# EAGLE design tester (EAGLE 7.3.0)
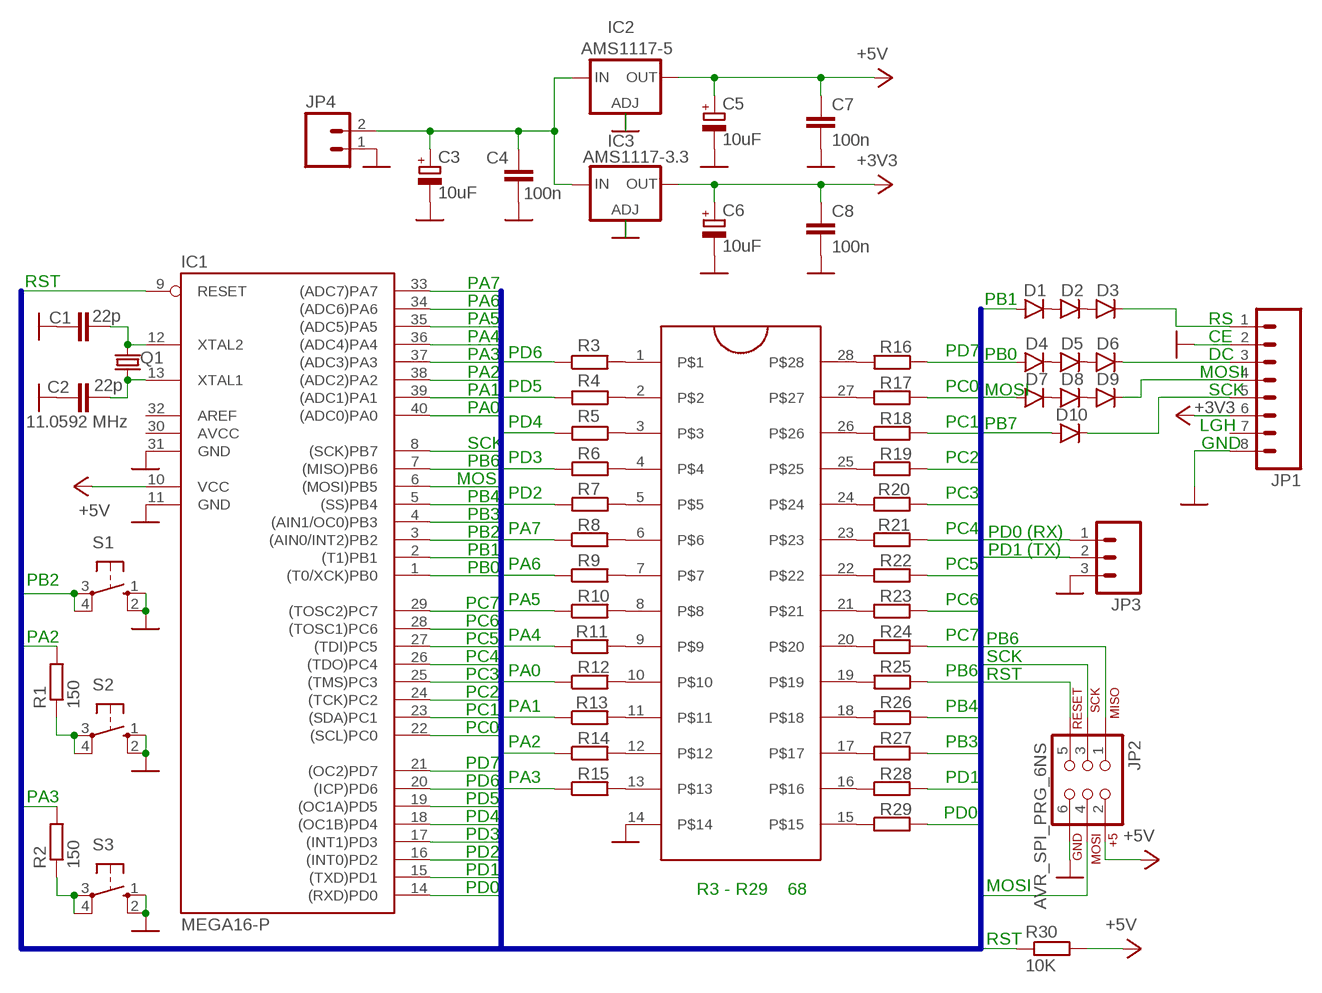
[diagram p0: schematic, sheet 1]

## Parts
C1  22p  C-EUC0805  [C0805]
C2  22p  C-EUC0805  [C0805]
C3  10uF  CPOL-EUE2.5-5  [E2,5-5]
C4  100n  C-EUC0805  [C0805]
C5  10uF  CPOL-EUE2.5-5  [E2,5-5]
C6  10uF  CPOL-EUE2.5-5  [E2,5-5]
C7  100n  C-EUC0805  [C0805]
C8  100n  C-EUC0805  [C0805]
D1  DIODESOD123  [SOD-123]
D2  DIODESOD123  [SOD-123]
D3  DIODESOD123  [SOD-123]
D4  DIODESOD123  [SOD-123]
D5  DIODESOD123  [SOD-123]
D6  DIODESOD123  [SOD-123]
D7  DIODESOD123  [SOD-123]
D8  DIODESOD123  [SOD-123]
D9  DIODESOD123  [SOD-123]
D10  DIODESOD123  [SOD-123]
IC1  MEGA16-P  [DIL40]
IC2  AMS1117-5  LD117AS50TR  [SOT223]
IC3  AMS1117-3.3  LD117AS33TR  [SOT223]
JP1  M08  [1X08_ROUND]
JP2  AVR_SPI_PRG_6NS  [2X3-NS]
JP3  M03PTH  [1X03]
JP4  M02PTH  [1X02]
Q1  11.0592 MHz  CRYSTALHC49S  [HC49/S]
R1  150  R-EU_M0805  [M0805]
R2  150  R-EU_M0805  [M0805]
R3  R-EU_M0805  [M0805]
R4  R-EU_M0805  [M0805]
R5  R-EU_M0805  [M0805]
R6  R-EU_M0805  [M0805]
R7  R-EU_M0805  [M0805]
R8  R-EU_M0805  [M0805]
R9  R-EU_M0805  [M0805]
R10  R-EU_M0805  [M0805]
R11  R-EU_M0805  [M0805]
R12  R-EU_M0805  [M0805]
R13  R-EU_M0805  [M0805]
R14  R-EU_M0805  [M0805]
R15  R-EU_M0805  [M0805]
R16  R-EU_M0805  [M0805]
R17  R-EU_M0805  [M0805]
R18  R-EU_M0805  [M0805]
R19  R-EU_M0805  [M0805]
R20  R-EU_M0805  [M0805]
R21  R-EU_M0805  [M0805]
R22  R-EU_M0805  [M0805]
R23  R-EU_M0805  [M0805]
R24  R-EU_M0805  [M0805]
R25  R-EU_M0805  [M0805]
R26  R-EU_M0805  [M0805]
R27  R-EU_M0805  [M0805]
R28  R-EU_M0805  [M0805]
R29  R-EU_M0805  [M0805]
R30  10K  R-EU_M0805  [M0805]
S1  10-XX  [B3F-10XX]
S2  10-XX  [B3F-10XX]
S3  10-XX  [B3F-10XX]
U$1  ZIFSOCKET-28-3ZIFFSOCKET-28-3  [DIL28-3-ZIF_SOCKET]

## Nets
+3V3: C6.+ C8.1 IC3.4(OUT) JP1.6
+5V: C5.+ C7.1 IC1.10(VCC) IC2.4(OUT) JP2.2 R30.2
GND: C1.1 C2.1 C3.- C4.1 C5.- C6.- C7.2 C8.2 IC1.11(GND) IC1.31(GND) IC2.1(ADJ) IC3.1(ADJ) JP1.2 JP1.8 JP2.6 JP3.3 JP4.1 S1.1(S) S1.2(S1) S2.1(S) S2.2(S1) S3.1(S) S3.2(S1) U$1.14
N$1: C2.2 IC1.13(XTAL1) Q1.1
N$2: C1.2 IC1.12(XTAL2) Q1.2
N$3: R16.2 U$1.28
N$4: R17.1 U$1.27
N$5: R18.1 U$1.26
N$6: R19.1 U$1.25
N$7: R20.1 U$1.24
N$8: R21.1 U$1.23
N$9: R22.1 U$1.22
N$10: R23.1 U$1.21
N$11: R24.1 U$1.20
N$12: R7.1 U$1.5
N$13: R6.1 U$1.4
N$14: R5.1 U$1.3
N$15: R4.1 U$1.2
N$16: R3.2 U$1.1
N$17: R8.2 U$1.6
N$18: R9.2 U$1.7
N$19: R10.2 U$1.8
N$20: R11.2 U$1.9
N$21: R12.2 U$1.10
N$22: R13.2 U$1.11
N$23: R14.2 U$1.12
N$24: R15.2 U$1.13
N$25: R25.2 U$1.19
N$26: R26.2 U$1.18
N$27: R27.1 U$1.17
N$28: R29.1 U$1.15
N$29: R28.1 U$1.16
N$30: C3.+ C4.2 IC2.3(IN) IC3.3(IN) JP4.2
N$31: R2.1 S3.3(P) S3.4(P1)
N$33: R1.1 S2.3(P) S2.4(P1)
N$37: D3.C JP1.1
N$38: D1.C D2.A
N$39: D2.C D3.A
N$40: D6.C JP1.3
N$41: D4.C D5.A
N$42: D9.C JP1.4
N$43: D5.C D6.A
N$44: D7.C D8.A
N$45: D8.C D9.A
N$46: D10.C JP1.5
PA0: IC1.40((ADC0)PA0) R12.1
PA1: IC1.39((ADC1)PA1) R13.1
PA2: IC1.38((ADC2)PA2) R1.2 R14.1
PA3: IC1.37((ADC3)PA3) R2.2 R15.1
PA4: IC1.36((ADC4)PA4) R11.1
PA5: IC1.35((ADC5)PA5) R10.1
PA6: IC1.34((ADC6)PA6) R9.1
PA7: IC1.33((ADC7)PA7) R8.1
PB0: D4.A IC1.1((T0/XCK)PB0)
PB1: D1.A IC1.2((T1)PB1)
PB2: IC1.3((AIN0/INT2)PB2) S1.3(P) S1.4(P1)
PB3: IC1.4((AIN1/OC0)PB3) R27.2
PB4: IC1.5((SS)PB4) R26.1
PB5: D7.A IC1.6((MOSI)PB5) JP2.4
PB6: IC1.7((MISO)PB6) JP2.1 R25.1
PB7: D10.A IC1.8((SCK)PB7) JP2.3
PC0: IC1.22((SCL)PC0) R17.2
PC1: IC1.23((SDA)PC1) R18.2
PC2: IC1.24((TCK)PC2) R19.2
PC3: IC1.25((TMS)PC3) R20.2
PC4: IC1.26((TDO)PC4) R21.2
PC5: IC1.27((TDI)PC5) R22.2
PC6: IC1.28((TOSC1)PC6) R23.2
PC7: IC1.29((TOSC2)PC7) R24.2
PD0: IC1.14((RXD)PD0) JP3.1 R29.2
PD1: IC1.15((TXD)PD1) JP3.2 R28.2
PD2: IC1.16((INT0)PD2) R7.2
PD3: IC1.17((INT1)PD3) R6.2
PD4: IC1.18((OC1B)PD4) R5.2
PD5: IC1.19((OC1A)PD5) R4.2
PD6: IC1.20((ICP)PD6) R3.1
PD7: IC1.21((OC2)PD7) R16.1
RESET: IC1.9(RESET) JP2.5 R30.1
Unconnected: IC1.32(AREF) JP1.7

## Buses
PA[0..7],PB[0..7],PC[0..7],PD[0..7],RESET

## Notes on the sheet
- RST | PA7
- PA6 | PB1
- PA5 | RS
- PA4 | CE
- PA3 | PD6 | PD7 | PB0 | DC
- PA2 | MOSI
- PA1 | PD5 | PC0 | MOSI | SCK
- PA0
- PD4 | PC1 | PB7 | LGH
- SCK | GND
- PB6 | PD3 | PC2
- MOSI
- PB4 | PD2 | PC3
- PB3
- PB2 | PA7 | PC4 | PD0 (RX)
- PB1 | PD1 (TX)
- PB0 | PA6 | PC5
- PB2
- PC7 | PA5 | PC6
- PC6
- PA2 | PC5 | PA4 | PC7 | PB6
- PC4 | SCK
- PC3 | PA0 | PB6 | RST
- PC2
- PC1 | PA1 | PB4
- PC0
- PA2 | PB3
- PD7
- PD6 | PA3 | PD1
- PA3 | PD5
- PD4 | PD0
- PD3
- PD2
- PD1
- PD0 | R3 - R29    68 | MOSI
- RST

## Power pins joined to a net without a drawn wire
AVCC: IC1.30(AVCC)

## Library data of the parts
C1 C2 C4 C7 C8 = rcl:C-EU: CAPACITOR, European symbol
C3 C5 C6 = rcl:CPOL-EU: POLARIZED CAPACITOR, European symbol
D1-D10 = SparkFun-DiscreteSemi:DIODE: Diode These are standard reverse protection diodes and small signal diodes. SMA package can handle up to about 1A. SOD-323 can handle about 200mA. What the SOD-323 package when ordering, there are some mfgs out there that are 5-pin packages.
IC1 = atmel:MEGA16-P: MICROCONTROLLER 16 Kbytes FLASH 1 kbytes SRAM 512 bytes EEPROM USART 8-channel 10 bit ADC Source: avr.lbr; MPN: ATMEGA16-16PU; OC_FARNELL: 9171142; OC_NEWARK: 01M6885
IC2 IC3 = v-reg:LD117A?*: Low drop fixed and adjustable positive voltage regulators 1 A Source: http://www.st.com/stonline/products/literature/ds/7194/ld1117axx.pdf
JP1 = SparkFun-Connectors:M08: Header 8 Standard 8-pin 0.1" header. Use with straight break away headers (SKU : PRT-00116), right angle break away headers (PRT-00553), swiss pins (PRT-00743), machine pins (PRT-00117), and female headers (PRT-00115).
JP2 = SparkFun-Connectors:AVR_SPI_PRG_6: AVR ISP 6 Pin This is the reduced ISP connector for AVR programming. Common on Arduino. This footprint will take up less PCB space and can be used with a 10-pin to 6-pin adapter such as SKU: BOB-08508 **Special note about "TEST_POINT" package. The stop mask is on the top side, so if you want your programming test points to be on the bottom of your board, make sure to place this package on the bottom side of the board. This also ensure that the orientation to program from the bottom side will be correct.
JP3 = SparkFun-Connectors:M03: Header 3 Standard 3-pin 0.1" header. Use with straight break away headers (SKU : PRT-00116), right angle break away headers (PRT-00553), swiss pins (PRT-00743), machine pins (PRT-00117), and female headers (PRT-00115). Molex polarized connector foot print use with SKU : PRT-08232 with associated crimp pins and housings.
JP4 = SparkFun-Connectors:M02: Standard 2-pin 0.1" header. Use with - straight break away headers ( PRT-00116) - right angle break away headers (PRT-00553) - swiss pins (PRT-00743) - machine pins (PRT-00117) - female headers (PRT-00115) Molex polarized connector foot print use with: PRT-08233 with associated crimp pins and housings. 2.54_SCREWTERM for use with PRT-10571. 3.5mm Screw Terminal footprints for PRT-08084 5mm Screw Terminal footprints for use with PRT-08432
Q1 = crystal:CRYSTAL: CRYSTAL; OC_FARNELL: 1667008; OC_NEWARK: unknown
R1-R30 = rcl:R-EU_: RESISTOR, European symbol
S1-S3 = switch-omron:10-XX: OMRON SWITCH; MPN: B3F-1000; OC_FARNELL: 176432; OC_NEWARK: 36M3542
U$1 = SparkFun-Connectors:ZIFSOCKET-28-3: Lever-action ZIF socket for 28-pin ICs

## Board
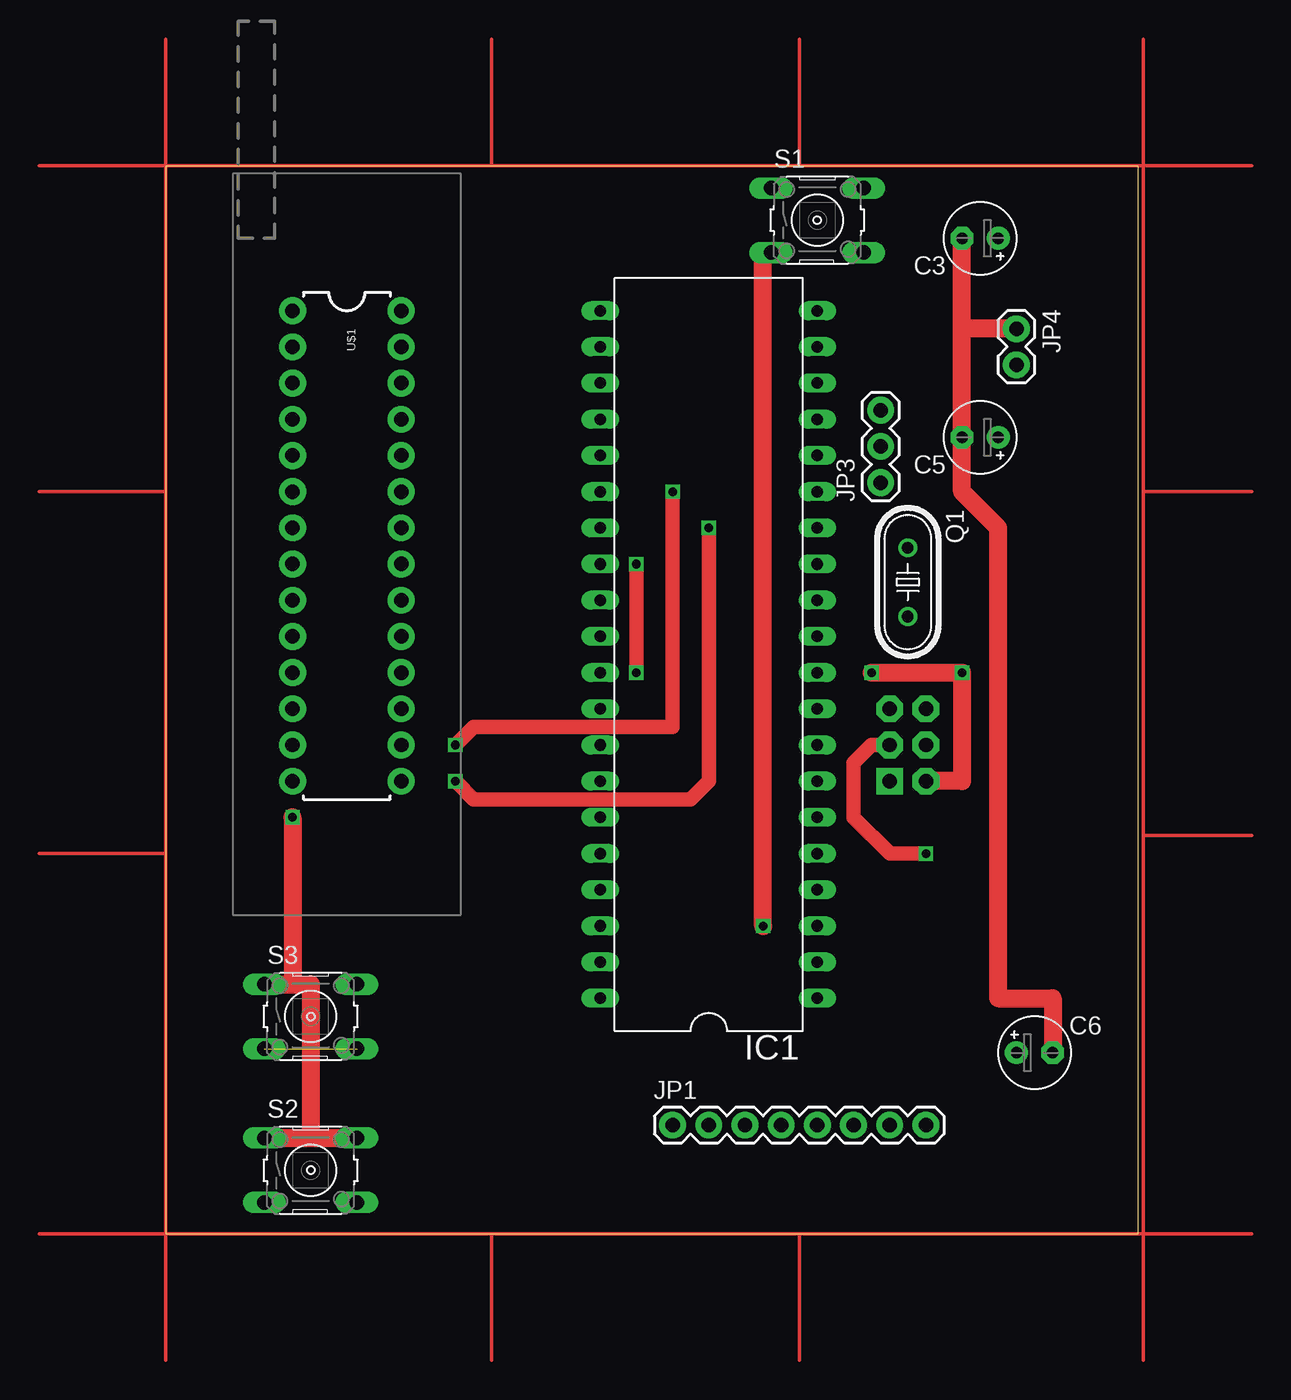
[diagram p1: board, top side]
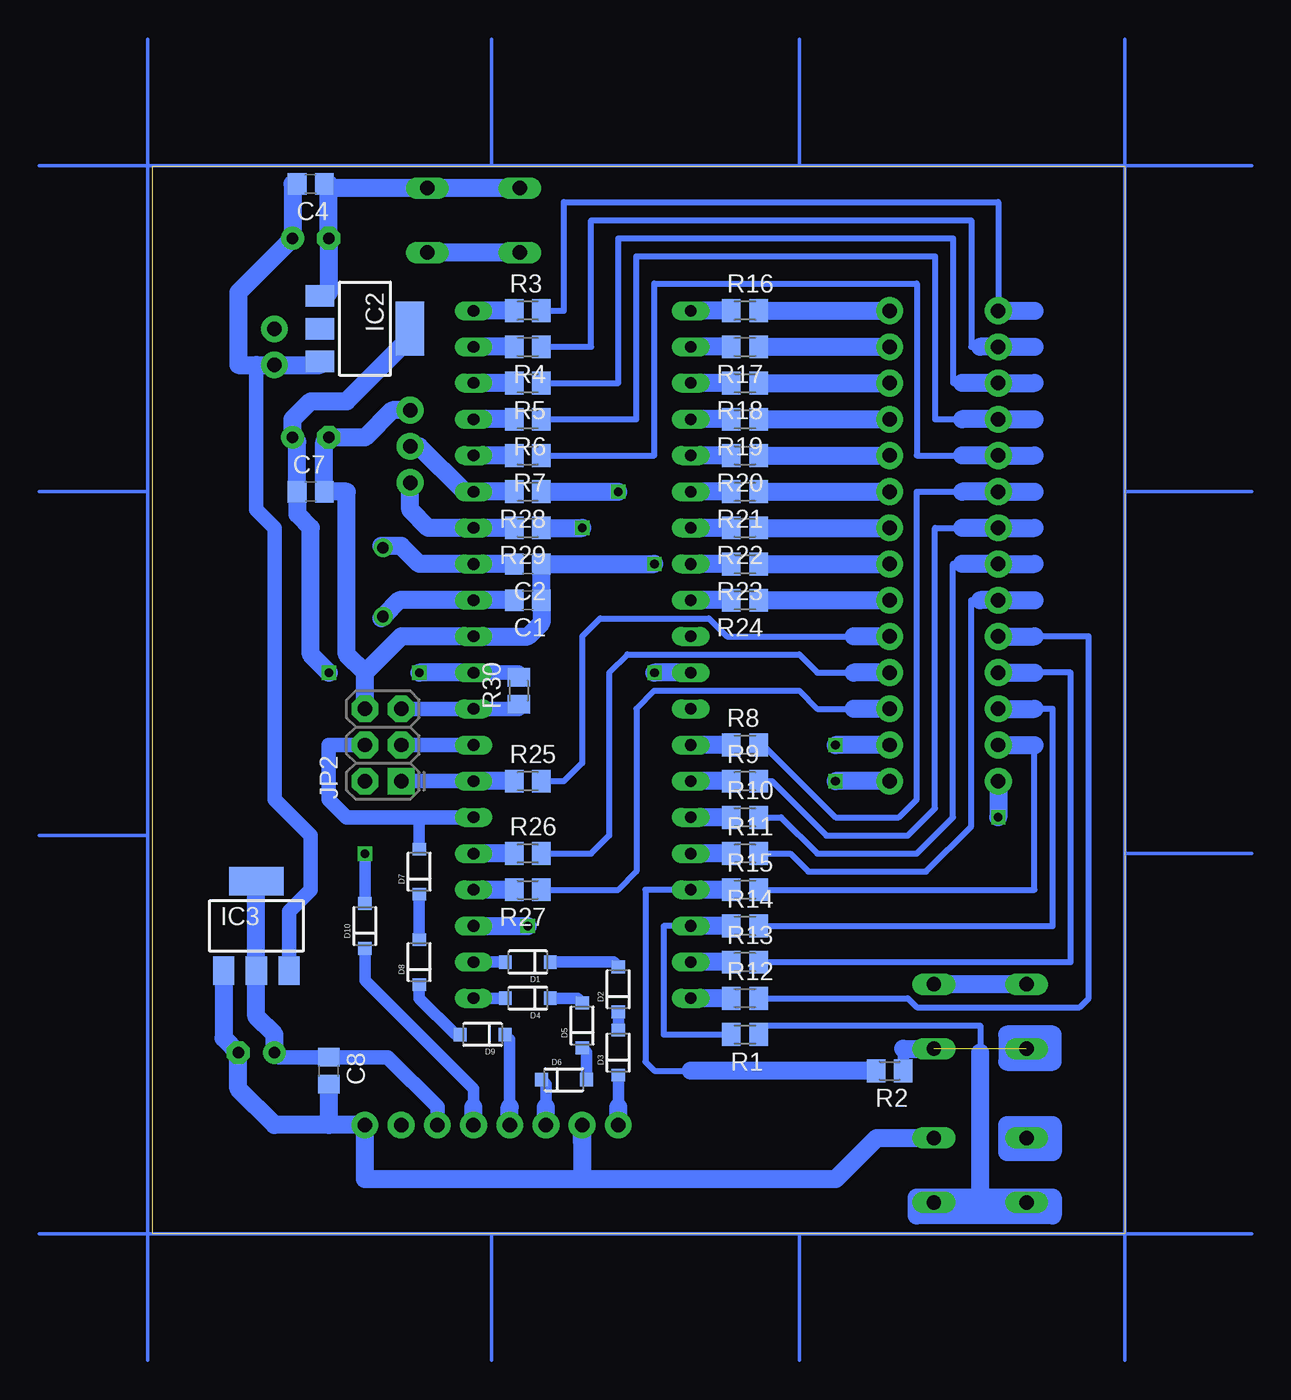
[diagram p2: board, bottom side, seen from below]

Size 68.25 x 74.92 mm. Coordinates in mm from the lower left corner, seen from the top.
Outline: 0,0 68.25,0 68.25,74.92 0,74.92 0,0
Copper layers (1*16): Top 0.035mm / dielectric 1.5mm / Bottom 0.035mm
Design rules "default": minimum track width 10mil, minimum drill 24mil, track to track 8mil, track to pad 8mil, pad to pad 8mil, via to via 8mil, smd to smd 8mil, copper to edge 40mil, drill to drill 8mil, minimum pad ring 10mil, minimum via ring 8mil, stop-mask expansion 4mil, vias tented up to drill 0mil, thermal gap 10mil

### Footprints (pad centres in the part's own frame; a part is rotated, then mirrored left to right if it is on the bottom)
C0805 = smd 1.3 x 1.5: 1 -0.95,0; 2 0.95,0
E2,5-5 = drill 0.813 pad 1.6: + -1.27,0 | drill 0.813 pad 1.6 octagon: - 1.27,0
SOD-123 = smd 0.9 x 0.95: A 1.575,0; C -1.575,0
DIL40 = drill 0.813 long: 1 -24.13,-7.62; 2 -21.59,-7.62; 3 -19.05,-7.62; 4 -16.51,-7.62; 5 -13.97,-7.62; 6 -11.43,-7.62; 7 -8.89,-7.62; 8 -6.35,-7.62; 9 -3.81,-7.62; 10 -1.27,-7.62; 11 1.27,-7.62; 12 3.81,-7.62; 13 6.35,-7.62; 14 8.89,-7.62; 15 11.43,-7.62; 16 13.97,-7.62; 17 16.51,-7.62; 18 19.05,-7.62; 19 21.59,-7.62; 20 24.13,-7.62; 21 24.13,7.62; 22 21.59,7.62; 23 19.05,7.62; 24 16.51,7.62; 25 13.97,7.62; 26 11.43,7.62; 27 8.89,7.62; 28 6.35,7.62; 29 3.81,7.62; 30 1.27,7.62; 31 -1.27,7.62; 32 -3.81,7.62; 33 -6.35,7.62; 34 -8.89,7.62; 35 -11.43,7.62; 36 -13.97,7.62; 37 -16.51,7.62; 38 -19.05,7.62; 39 -21.59,7.62; 40 -24.13,7.62
SOT223 = smd 1.5 x 2: 1 -2.3,-3.15; 2 0,-3.15; 3 2.3,-3.15 | smd 3.8 x 2: 4 0,3.15
1X08_ROUND = drill 1.016 pad 1.88: 1 0,0; 2 2.54,0; 3 5.08,0; 4 7.62,0; 5 10.16,0; 6 12.7,0; 7 15.24,0; 8 17.78,0
2X3-NS = drill 1.016 pad 1.88 square: 1 -2.54,-1.27 | drill 1.016 pad 1.88 octagon: 2 -2.54,1.27; 3 0,-1.27; 4 0,1.27; 5 2.54,-1.27; 6 2.54,1.27
1X03 = drill 1.016 pad 1.88: 1 0,0; 2 2.54,0; 3 5.08,0
1X02 = drill 1.016 pad 1.88: 1 0,0; 2 2.54,0
HC49/S = drill 0.813: 1 -2.413,0; 2 2.413,0
M0805 = smd 1.3 x 1.6: 1 -0.95,0; 2 0.95,0
B3F-10XX = drill 1.016 long: 1 -3.251,2.261; 2 3.251,2.261; 3 -3.251,-2.261; 4 3.251,-2.261
DIL28-3-ZIF_SOCKET = drill 1.016 pad 1.88: 1 -16.51,-3.81; 2 -13.97,-3.81; 3 -11.43,-3.81; 4 -8.89,-3.81; 5 -6.35,-3.81; 6 -3.81,-3.81; 7 -1.27,-3.81; 8 1.27,-3.81; 9 3.81,-3.81; 10 6.35,-3.81; 11 8.89,-3.81; 12 11.43,-3.81; 13 13.97,-3.81; 14 16.51,-3.81; 15 16.51,3.81; 16 13.97,3.81; 17 11.43,3.81; 18 8.89,3.81; 19 6.35,3.81; 20 3.81,3.81; 21 1.27,3.81; 22 -1.27,3.81; 23 -3.81,3.81; 24 -6.35,3.81; 25 -8.89,3.81; 26 -11.43,3.81; 27 -13.97,3.81; 28 -16.51,3.81

### Placement (x,y rotation side)
C1  41.91,44.45 180 bottom
C2  41.91,46.99 180 bottom
C3  57.15,69.85 180 top
C4  57.15,73.66 180 bottom
C5  57.15,55.88 180 top
C6  60.96,12.7 0 top
C7  57.15,52.07 0 bottom
C8  55.88,11.43 270 bottom
D1  41.91,19.05 180 bottom
D2  35.56,17.14 90 bottom
D3  35.56,12.7 90 bottom
D4  41.91,16.51 180 bottom
D5  38.1,14.61 90 bottom
D6  39.37,10.79 0 bottom
D7  49.53,25.4 90 bottom
D8  49.53,19.05 90 bottom
D9  45.09,13.97 180 bottom
D10  53.34,21.59 90 bottom
IC1  38.1,40.64 90 top
IC2  53.34,63.5 270 bottom
IC3  60.96,21.59 0 bottom
JP1  35.56,7.62 0 top
JP2  52.07,34.29 90 bottom
JP3  50.16,52.7 90 top
JP4  59.69,63.5 270 top
Q1  52.07,45.72 270 top
R1  26.67,13.97 180 bottom
R2  16.51,11.43 180 bottom
R3  41.91,64.77 0 bottom
R4  41.91,62.23 180 bottom
R5  41.91,59.69 180 bottom
R6  41.91,57.15 180 bottom
R7  41.91,54.61 180 bottom
R8  26.67,34.29 0 bottom
R9  26.67,31.75 0 bottom
R10  26.67,29.21 0 bottom
R11  26.67,26.67 0 bottom
R12  26.67,16.51 0 bottom
R13  26.67,19.05 0 bottom
R14  26.67,21.59 0 bottom
R15  26.67,24.13 0 bottom
R16  26.67,64.77 0 bottom
R17  26.67,62.23 180 bottom
R18  26.67,59.69 180 bottom
R19  26.67,57.15 180 bottom
R20  26.67,54.61 180 bottom
R21  26.67,52.07 180 bottom
R22  26.67,49.53 180 bottom
R23  26.67,46.99 180 bottom
R24  26.67,44.45 180 bottom
R25  41.91,31.75 0 bottom
R26  41.91,26.67 0 bottom
R27  41.91,24.13 180 bottom
R28  41.91,52.07 180 bottom
R29  41.91,49.53 180 bottom
R30  42.55,38.1 90 bottom
S1  45.72,71.12 0 top
S2  10.16,4.45 0 top
S3  10.16,15.24 0 top
U$1  12.7,48.26 270 top

### Tracks (layer width: path | path; a pad name or v marks a point on that pad's centre or on a via)
+3V3
  Bottom 1.016: JP1.6 48.26,8.89 51.75,12.38 C8.1 59.37,12.38 C6.+
  Bottom 1.27: C6.+ 59.69,13.97 60.96,15.24 IC3.4
+5V  (via drill 0.6)
  Top 1.27: v49.53,39.37 v55.88,39.37 55.88,31.75 JP2.2
  Bottom 1.016: IC1.10 42.55,39.37 R30.2
  Bottom 1.27: IC2.4 50.16,63.48 50.16,62.87 54.61,58.42 57.15,58.42 58.42,57.15 C5.+ 58.1,55.56 C7.1 58.1,50.48 57.15,49.53 57.15,40.64 v55.88,39.37 | IC1.10 v49.53,39.37
GND  (via drill 0.6)
  Top 1.016: v33.02,46.99 v33.02,39.37
  Top 1.27: 55.88,63.5 C5.- 55.88,52.07 58.42,49.53 58.42,16.51 62.23,16.51 C6.- | S3.1 8.89,17.5 | 8.89,17.5 10.16,17.5 10.16,6.71 | S2.1 10.16,6.71 | 10.16,6.71 S2.2 | v8.89,29.21 8.89,17.5 | JP4.1 55.88,63.5 | 55.88,63.5 C3.-
  Bottom 1.27: 53.34,39.37 50.8,41.91 IC1.11 41.91,41.91 40.96,42.86 C1.1 C2.1 v33.02,46.99 | JP3.3 51.44,57.78 53.34,55.88 C5.- 56.2,55.56 C7.2 54.61,52.07 54.61,40.64 53.34,39.37 | 38.1,3.81 JP1.2 38.1,6.35 | 38.1,3.81 53.34,3.81 JP1.8 55.88,7.62 | S1.1 S1.2 55.92,73.38 C4.1 55.88,73.66 C3.- 55.88,66.04 IC2.1 | JP2.6 53.34,39.37 | IC1.31 v33.02,39.37 | S3.1 S3.2 | U$1.14 v8.89,29.21 | 38.1,3.81 20.32,3.81 17.42,6.71 S2.2 | 55.88,7.62 59.69,7.62 62.23,10.16 C6.- 63.26,13.73 IC3.1 | C8.2 55.88,7.62
N$1
  Bottom 1.27: 52.2,48.26 Q1.1 51.94,48.26 50.8,48.26 49.53,46.99 IC1.13 C2.2
N$2
  Bottom 1.27: 52.2,43.18 Q1.2 50.93,44.45 IC1.12 C1.2
N$3
  Bottom 1.27: R16.2 U$1.28
N$4
  Bottom 1.27: R17.1 U$1.27
N$5
  Bottom 1.27: R18.1 U$1.26
N$6
  Bottom 1.27: R19.1 U$1.25
N$7
  Bottom 1.27: R20.1 U$1.24
N$8
  Bottom 1.27: R21.1 U$1.23
N$9
  Bottom 1.27: R22.1 U$1.22
N$10
  Bottom 1.27: R23.1 U$1.21
N$11
  Bottom 1.27: R24.1 U$1.20
N$12
  Bottom 0.406: R7.1 33.02,54.61 33.02,66.67 14.61,66.67 14.61,54.61 11.43,54.61
  Bottom 1.27: 6.35,54.61 U$1.5 11.43,54.61
N$13
  Bottom 0.406: R6.1 34.29,57.15 34.29,68.58 13.34,68.58 13.34,57.15 11.43,57.15
  Bottom 1.27: 6.35,57.15 U$1.4 11.43,57.15
N$14
  Bottom 0.406: R5.1 35.56,59.69 35.56,69.85 12.07,69.85 12.07,59.69 11.43,59.69
  Bottom 1.27: 6.35,59.69 U$1.3 11.43,59.69
N$15
  Bottom 0.406: R4.1 37.47,62.23 37.47,71.12 10.8,71.12 10.8,62.23 10.16,62.23
  Bottom 1.27: 6.35,62.23 U$1.2 10.16,62.23
N$16
  Bottom 0.406: R3.2 39.37,64.77 39.37,72.39 8.89,72.39 U$1.1
  Bottom 1.27: U$1.1 6.35,64.77
N$17
  Bottom 0.406: R8.2 25.4,34.29 20.32,29.21 15.88,29.21 14.61,30.48 14.61,52.07 11.43,52.07
  Bottom 1.27: 11.43,52.07 U$1.6 6.35,52.07
N$18
  Bottom 0.406: R9.2 24.77,31.75 20.95,27.94 15.24,27.94 13.34,29.84 13.34,49.53 11.43,49.53
  Bottom 1.27: 11.43,49.53 U$1.7 6.35,49.53
N$19
  Bottom 0.406: R10.2 24.13,29.21 21.59,26.67 14.61,26.67 12.07,29.21 12.07,46.99 11.43,46.99
  Bottom 1.27: 11.43,46.99 U$1.8 6.35,46.99
N$20
  Bottom 0.406: R11.2 23.49,26.67 22.23,25.4 13.97,25.4 10.8,28.57 10.8,44.45 10.16,44.45
  Bottom 1.27: 10.16,44.45 U$1.9 6.35,44.45
N$21
  Bottom 0.406: 6.35,41.91 2.54,41.91 2.54,16.51 3.18,15.88 14.61,15.88 15.24,16.51 R12.2
  Bottom 1.27: U$1.10 6.35,41.91
N$22
  Bottom 0.406: R13.2 3.81,19.05 3.81,39.37 6.35,39.37
  Bottom 1.27: U$1.11 6.35,39.37
N$23
  Bottom 0.406: R14.2 5.08,21.59 5.08,36.83 6.35,36.83
  Bottom 1.27: U$1.12 6.35,36.83
N$24
  Bottom 0.406: R15.2 6.35,24.13 6.35,34.29
  Bottom 1.27: U$1.13 6.35,34.29
N$25
  Bottom 0.406: 19.05,41.91 27.94,41.91 29.21,43.18 36.83,43.18 38.1,41.91 38.1,33.02 39.37,31.75 R25.2
  Bottom 1.27: U$1.19 19.05,41.91
N$26
  Bottom 0.406: R26.2 37.47,26.67 36.2,27.94 36.2,39.37 34.92,40.64 22.86,40.64 21.59,39.37 19.05,39.37
  Bottom 1.27: U$1.18 19.05,39.37
N$27
  Bottom 0.406: R27.1 35.56,24.13 34.29,25.4 34.29,36.83 33.02,38.1 22.86,38.1 21.59,36.83 19.05,36.83
  Bottom 1.27: U$1.17 19.05,36.83
N$28  (via drill 0.6)
  Top 1.016: v20.32,31.75 21.59,30.48 36.83,30.48 38.1,31.75 v38.1,49.53
  Bottom 1.27: U$1.15 v20.32,31.75 | R29.1 v38.1,49.53
N$29  (via drill 0.6)
  Top 1.016: v35.56,52.07 35.56,35.56 21.59,35.56 v20.32,34.29
  Bottom 1.27: U$1.16 v20.32,34.29 | R28.1 v35.56,52.07
N$30
  Bottom 1.016: IC3.3 58.66,22.62 57.15,24.13 57.15,27.94 59.69,30.48 59.69,49.53 60.96,50.8 60.96,60.96
  Bottom 1.27: C4.2 58.42,73.66 C3.+ 62.23,66.04 62.23,60.96 60.96,60.96 JP4.2 56.49,60.96 IC2.3
N$31  (1 unrouted)
  Bottom 0.813: R2.1 15.56,12.98
  Bottom 1.27: 15.56,12.98 S3.4
N$32
  Bottom 1.27: 5.08,12.7 5.08,12.06 8.25,12.06 8.25,13.97 5.08,13.97 5.08,12.7 | 5.08,12.7 7.62,12.7
N$33
  Bottom 0.406: R1.1 25.09,14.61 10.16,14.61 10.16,12.7
  Bottom 1.27: S2.4 10.16,2.18 | S2.3 10.16,2.18 | 10.16,2.18 10.16,12.7
N$34
  Bottom 1.27: 14.61,1.27 14.61,2.54 5.08,2.54 5.08,1.27 14.61,1.27
N$35
  Bottom 1.27: 5.08,6.35 5.08,7.62 8.25,7.62 8.25,5.71 5.08,5.71 5.08,6.35 | 7.62,6.35 5.08,6.35
N$36
  Bottom 0.254: 0,74.93 22.86,74.93 | 22.86,74.93 44.45,74.93 | 44.45,74.93 68.58,74.93 | 68.58,74.93 68.58,52.07 | 68.58,52.07 68.58,27.94 | 68.58,27.94 68.58,0 | 68.58,0 44.45,0 | 44.45,0 22.86,0 | 22.86,0 0,0 | 0,0 0,26.67 | 0,26.67 0,52.07 | 0,52.07 0,74.93 | 0,83.82 0,74.93 | 0,74.93 -8.89,74.93 | 22.86,83.82 22.86,74.93 | 44.45,83.82 44.45,74.93 | -8.89,52.07 0,52.07 | -8.89,26.67 0,26.67 | -8.89,0 0,0 | 0,0 0,-8.89 | 22.86,-8.89 22.86,0 | 44.45,-8.89 44.45,0 | 68.58,-8.89 68.58,0 | 76.2,0 68.58,0 | 76.2,27.94 68.58,27.94 | 76.2,52.07 68.58,52.07 | 76.2,74.93 68.58,74.93 | 68.58,74.93 68.58,83.82
N$37
  Bottom 0.813: 35.56,8.89 D3.C
  Bottom 1.27: JP1.1 35.56,8.89
N$38
  Bottom 0.813: D1.C 35.89,19.05 D2.A
N$39
  Bottom 0.813: D3.A D2.C
N$40
  Bottom 0.813: 40.64,8.89 40.64,10.49 D6.C
  Bottom 1.27: JP1.3 40.64,8.89
N$41
  Bottom 0.813: D4.C 38.43,16.51 D5.A
N$42
  Bottom 0.813: 43.18,8.89 43.18,13.64 D9.C
  Bottom 1.27: JP1.4 43.18,8.89
N$43
  Bottom 0.813: D6.A 37.8,12.72 D5.C
N$44
  Bottom 0.813: D8.A D7.C
N$45
  Bottom 0.813: D9.A 46.99,13.97 49.53,16.51 D8.C
N$46
  Bottom 0.813: 45.72,8.89 45.72,10.16 53.34,17.78 D10.C
  Bottom 1.27: JP1.5 45.72,8.89
N$49
  Top 0.254: 0,74.93 0,52.07 | 0,52.07 0,26.67 | 0,26.67 0,0 | 0,0 22.86,0 | 22.86,0 44.45,0 | 44.45,0 68.58,0 | 68.58,0 68.58,27.94 | 68.58,27.94 68.58,52.07 | 68.58,52.07 68.58,74.93 | 68.58,74.93 44.45,74.93 | 44.45,74.93 22.86,74.93 | 22.86,74.93 0,74.93 | 0,74.93 0,83.82 | 0,74.93 -8.89,74.93 | 68.58,74.93 68.58,83.82 | 68.58,74.93 76.2,74.93 | 68.58,0 76.2,0 | 68.58,0 68.58,-8.89 | 0,0 -8.89,0 | 0,0 0,-8.89 | 22.86,74.93 22.86,83.82 | 44.45,74.93 44.45,83.82 | 0,52.07 -8.89,52.07 | 0,26.67 -8.89,26.67 | 22.86,0 22.86,-8.89 | 44.45,0 44.45,-8.89 | 68.58,52.07 76.2,52.07 | 68.58,27.94 76.2,27.94
PA0
  Bottom 1.27: R12.1 IC1.40
PA1
  Bottom 1.27: R13.1 IC1.39
PA2
  Bottom 0.406: R14.1 32.38,21.59 32.38,13.97 R1.2
  Bottom 1.27: R14.1 IC1.38
PA3
  Bottom 0.406: IC1.37 33.66,24.13 33.66,12.06 33.02,11.43 30.48,11.43
  Bottom 1.27: R15.1 IC1.37 | R2.2 30.48,11.43
PA4
  Bottom 1.27: R11.1 IC1.36
PA5
  Bottom 1.27: R10.1 IC1.35
PA6
  Bottom 1.27: R9.1 IC1.34
PA7
  Bottom 1.27: R8.1 IC1.33
PB0
  Bottom 0.813: IC1.1 D4.A
PB1
  Bottom 0.813: D1.A IC1.2
PB2  (via drill 0.6)
  Top 1.016: 41.91,68.3 S1.3
  Top 1.27: v41.91,21.59 41.91,68.3
  Bottom 1.27: IC1.3 v41.91,21.59 | S1.3 S1.4
PB3
  Bottom 1.27: R27.2 IC1.4
PB4
  Bottom 1.27: R26.1 IC1.5
PB5
  Bottom 0.813: D7.A 49.53,29.21
  Bottom 1.016: IC1.6 49.53,29.21 54.61,29.21 55.88,30.48 55.88,34.29 JP2.4
PB6
  Bottom 1.016: IC1.7 JP2.1
  Bottom 1.27: R25.1 IC1.7
PB7  (via drill 0.6)
  Top 1.016: v53.34,26.67 50.8,26.67 48.26,29.21 48.26,33.02 49.53,34.29 JP2.3
  Bottom 0.813: D10.A v53.34,26.67
  Bottom 1.016: JP2.3 IC1.8
PC0
  Bottom 1.27: R17.2 IC1.22
PC1
  Bottom 1.27: R18.2 IC1.23
PC2
  Bottom 1.27: R19.2 IC1.24
PC3
  Bottom 1.27: R20.2 IC1.25
PC4
  Bottom 1.27: R21.2 IC1.26
PC5
  Bottom 1.27: R22.2 IC1.27
PC6
  Bottom 1.27: R23.2 IC1.28
PC7
  Bottom 1.27: R24.2 IC1.29
PD0
  Bottom 1.27: R29.2 IC1.14 48.9,49.53 50.16,50.8 JP3.1
PD1
  Bottom 1.27: R28.2 IC1.15 46.35,52.07 49.53,55.24 JP3.2
PD2
  Bottom 1.27: R7.2 IC1.16
PD3
  Bottom 1.27: R6.2 IC1.17
PD4
  Bottom 1.27: R5.2 IC1.18
PD5
  Bottom 1.27: R4.2 IC1.19
PD6
  Bottom 1.27: R3.1 IC1.20
PD7
  Bottom 1.27: R16.1 IC1.21
RESET
  Bottom 1.016: R30.1 42.55,36.83 IC1.9 JP2.5